# Altium project Roll_Paper_Motor.PrjPCB
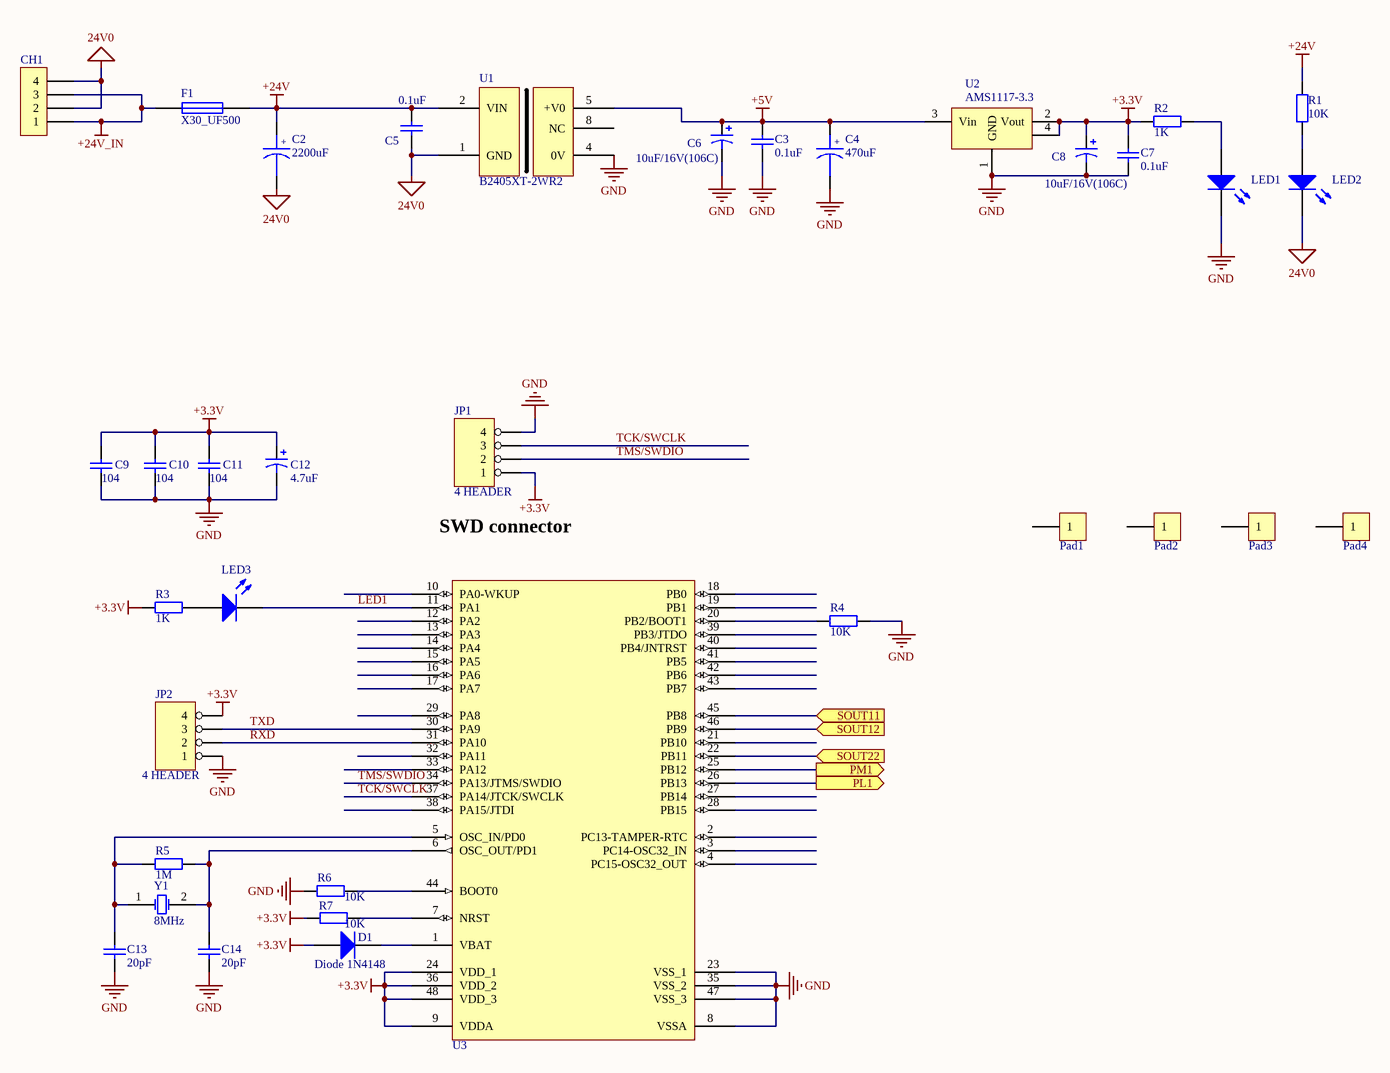
[diagram p0: power_cpu.SchDoc]
3 sheets, 80 parts. Net scope: flat (ports and power ports of the same name join across sheets).
Board files: Roll_Paper_Motor.PcbDoc, PCB_size.PcbDoc
Sheets:
  power_cpu.SchDoc
  senror_input.SchDoc
  roll_paper_output.SchDoc

## Sheet power_cpu.SchDoc
size A3

### Parts
C2  C_2200uF  [C7.8*17]  (value not drawn)
C3  value 0.1uF  [0805]  (hidden comment: Cap)
C4  C_2200uF  [C5*10]  (value not drawn)
C5  value 0.1uF  [0805]  (hidden comment: Cap)
C6  value 10uF/16V(106C)  [CAP A-3216]  (hidden comment: Cap Pol3)
C7  value 0.1uF  [0805]  (hidden comment: Cap)
C8  value 10uF/16V(106C)  [CAP A-3216]  (hidden comment: Cap Pol3)
C9  value 104  [0805]  (hidden comment: Cap)
C10  value 104  [0805]  (hidden comment: Cap)
C11  value 104  [0805]  (hidden comment: Cap)
C12  value 4.7uF  [3225[1210]]  (hidden comment: Cap Pol1)
C13  value 20pF  [0805]  (hidden comment: Cap)
C14  value 20pF  [0805]  (hidden comment: Cap)
CH1  HEADER1X4  [CH3.96-4PIN]  (value not drawn)
D1  Diode 1N4148  [LL34]
F1  X30_UF500  [X30UF600]
JP1  4 HEADER  [CON4_1.5]
JP2  4 HEADER  [HDR1X4]
LED1  (no value)  [LED-0805]
LED2  (no value)  [LED-0805]
LED3  (no value)  [LED-0805]
Pad1  Pad  [pad35]  (value not drawn)
Pad2  Pad  [pad35]  (value not drawn)
Pad3  Pad  [pad35]  (value not drawn)
Pad4  Pad  [pad35]  (value not drawn)
R1  value 10K  [0805]  (hidden comment: Res2)
R2  value 1K  [0805]  (hidden comment: Res2)
R3  value 1K  [0805]  (hidden comment: Res2)
R4  value 10K  [0805]  (hidden comment: Res2)
R5  value 1M  [0805]  (hidden comment: Res2)
R6  value 10K  [0805]  (hidden comment: Res2)
R7  value 10K  [0805]  (hidden comment: Res2)
U1  B2405XT-2WR2  [B2405XT-2WR2]
U2  AMS1117-3.3  [SOT223]
U3  STM32F103C8T6  [LQFP48]  (value not drawn)
Y1  8MHz  [XTAL_US]

### Ports
PL1 (out), PM1 (out), SOUT11 (in), SOUT12 (in), SOUT22 (in)

### Nets
24V0: C2.2 C5.1 CH1.2 CH1.4 LED2.2(K) U1.1(GND)
+3.3V: C7.2 C8.1 C9.2 C10.2 C11.2 C12.1 D1.1(A) JP1.1 JP2.4 R2.2 R3.2 R7.1 U2.2(Vout) U2.4 U3.9(VDDA) U3.24(VDD_1) U3.36(VDD_2) U3.48(VDD_3)
+5V: C3.2 C4.1 C6.1 U1.5(+V0) U2.3(Vin)
+24V: C2.1 C5.2 F1.2 R1.2 U1.2(VIN)
+24V_IN: CH1.1 CH1.3 F1.1
GND: C3.1 C4.2 C6.2 C7.1 C8.2 C9.1 C10.1 C11.1 C12.2 C13.1 C14.1 JP1.4 JP2.1 LED1.2(K) R4.2 R6.1 U1.4(0V) U2.1(GND) U3.8(VSSA) U3.23(VSS_1) U3.35(VSS_2) U3.47(VSS_3)
LED1: LED3.2(K) U3.11(PA1)
RXD: JP2.2 U3.31(PA10)
TCK/SWCLK: JP1.3 U3.37(PA14/JTCK/SWCLK)
TMS/SWDIO: JP1.2 U3.34(PA13/JTMS/SWDIO)
TXD: JP2.3 U3.30(PA9)
NetC13_2: C13.2 R5.1 U3.5(OSC_IN/PD0) Y1.1(OSC1)
NetC14_2: C14.2 R5.2 U3.6(OSC_OUT/PD1) Y1.2(OSC2)
NetC18_2: U3.46(PB9) ; port SOUT12
NetC20_2: U3.45(PB8) ; port SOUT11
NetC24_2: U3.22(PB11) ; port SOUT22
NetD1_2: D1.2(K) U3.1(VBAT)
NetLED1_1: LED1.1(A) R2.1
NetLED2_1: LED2.1(A) R1.1
NetLED3_1: LED3.1(A) R3.1
NetR4_1: R4.1 U3.20(PB2/BOOT1)
NetR6_2: R6.2 U3.44(BOOT0)
NetR7_2: R7.2 U3.7(NRST)
NetR9_1: U3.25(PB12) ; port PM1
NetR11_1: U3.26(PB13) ; port PL1

Not connected (* = marked no-connect by the designer): Pad1 1; Pad2 1; Pad3 1; Pad4 1; U1 8(NC); U3 2(PC13-TAMPER-RTC) 3(PC14-OSC32_IN) 4(PC15-OSC32_OUT) 10(PA0-WKUP) 12(PA2) 13(PA3) 14(PA4) 15(PA5) 16(PA6) 17(PA7) 18(PB0) 19(PB1) 21(PB10) 27(PB14) 28(PB15) 29(PA8) 32(PA11) 33(PA12) 38(PA15/JTDI) 39(PB3/JTDO) 40(PB4/JNTRST) 41(PB5) 42(PB6) 43(PB7)

### Notes on the sheet
- SWD connector
- (in symbol C_2200uF) +; 2200uF; 470uF

### Library data of the parts
C3 C5 C7 C9-C11 C13 C14 = Cap: Capacitor; Published: 8-Jun-2000; LatestRevisionDate: 17-Jul-2002; LatestRevisionNote: Re-released for DXP Platform.; Publisher: Altium Limited
  C3 C5 C7 C9-C11: PackageReference: RAD-0.3
C6 C8 = Cap Pol3: Polarized Capacitor (Surface Mount); Published: 8-Jun-2000; LatestRevisionDate: 17-Jul-2002; LatestRevisionNote: Re-released for DXP Platform.; PackageReference: C0805; Publisher: Altium Limited
C12 = Cap Pol1: Polarized Capacitor (Radial); Published: 8-Jun-2000; LatestRevisionDate: 17-Jul-2002; LatestRevisionNote: Re-released for DXP Platform.; PackageReference: RB7.6-15; Publisher: Altium Limited
D1 = Diode 1N4148: High Conductance Fast Diode; Published: 8-Jun-2000; LatestRevisionDate: 17-Jul-2002; LatestRevisionNote: Re-released for DXP Platform.; DatasheetDocument: 1997; PackageReference: DO-35; Publisher: Altium Limited; Code_JEDEC: DO-204-AH; ComponentLink1Description: Manufacturer Link; ComponentLink1URL: http://www.fairchildsemi.com/; ComponentLink2Description: Datasheet; ComponentLink2URL: http://www.fairchildsemi.com/ds/1N%2F1N4148.pdf
F1 = Fuse 1: Fuse; Published: 8-Jun-2000; LatestRevisionDate: 17-Jul-2002; LatestRevisionNote: Re-released for DXP Platform.; PackageReference: PIN-W2/E2.8; Publisher: Altium Limited
JP1 JP2 = 4 HEADER: 4 Pin Header
LED1-LED3 = LED2: Typical RED, GREEN, YELLOW, AMBER GaAs LED; Published: 8-Jun-2000; LatestRevisionDate: 17-Jul-2002; LatestRevisionNote: Re-released for DXP Platform.; PackageDocument: Feb-2002; PackageReference: 3.2X1.6X1.1; Publisher: Altium Limited
R1-R7 = Res2: Resistor; Published: 8-Jun-2000; LatestRevisionDate: 17-Jul-2002; LatestRevisionNote: Re-released for DXP Platform.; Publisher: Altium Limited
  R1-R3: PackageReference: AXIAL-0.4
U2 = AMS1117-5
Y1 = XTAL: Crystal Oscillator; Published: 8-Jun-2000; LatestRevisionDate: 17-Jul-2002; LatestRevisionNote: Re-released for DXP Platform.; Publisher: Altium Limited

## Sheet senror_input.SchDoc
size A3
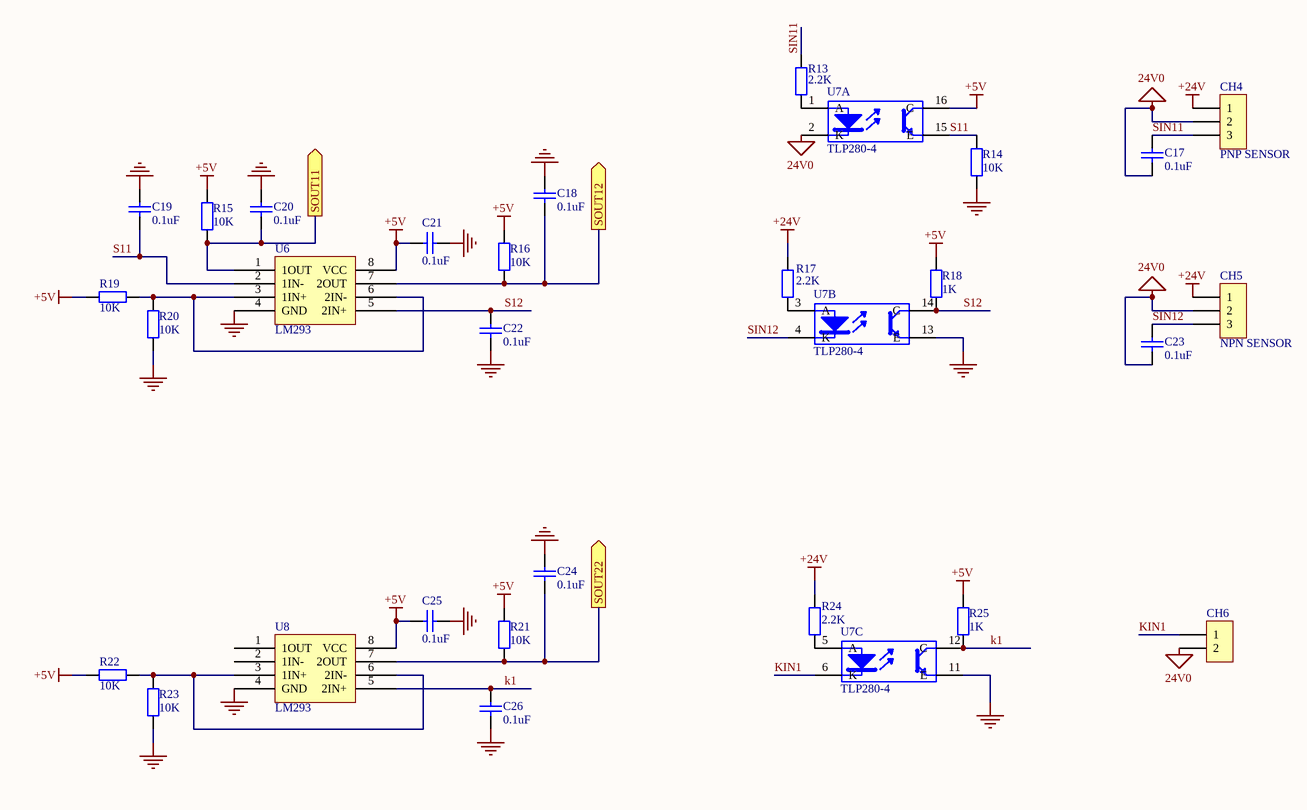
[diagram p1: senror_input.SchDoc]

### Parts
C17  value 0.1uF  [0805]  (hidden comment: Cap)
C18  value 0.1uF  [0805]  (hidden comment: Cap)
C19  value 0.1uF  [0805]  (hidden comment: Cap)
C20  value 0.1uF  [0805]  (hidden comment: Cap)
C21  value 0.1uF  [0805]  (hidden comment: Cap)
C22  value 0.1uF  [0805]  (hidden comment: Cap)
C23  value 0.1uF  [0805]  (hidden comment: Cap)
C24  value 0.1uF  [0805]  (hidden comment: Cap)
C25  value 0.1uF  [0805]  (hidden comment: Cap)
C26  value 0.1uF  [0805]  (hidden comment: Cap)
CH4  HEADER1X3  [CH3.96-3PIN]  (value not drawn)
CH5  HEADER1X3  [CH3.96-3PIN]  (value not drawn)
CH6  HEADER1X2  [CH3.96-2PIN]  (value not drawn)
R13  value 2.2K  [0805]  (hidden comment: Res2)
R14  value 10K  [0805]  (hidden comment: Res2)
R15  value 10K  [0805]  (hidden comment: Res2)
R16  value 10K  [0805]  (hidden comment: Res2)
R17  value 2.2K  [0805]  (hidden comment: Res2)
R18  value 1K  [0805]  (hidden comment: Res2)
R19  value 10K  [0805]  (hidden comment: Res2)
R20  value 10K  [0805]  (hidden comment: Res2)
R21  value 10K  [0805]  (hidden comment: Res2)
R22  value 10K  [0805]  (hidden comment: Res2)
R23  value 10K  [0805]  (hidden comment: Res2)
R24  value 2.2K  [0805]  (hidden comment: Res2)
R25  value 1K  [0805]  (hidden comment: Res2)
U6  LM293  [SOP8-OP27]
U7  TLP280-4  [SO16]  (parts A,B,C of 4)
U8  LM293  [SOP8-OP27]

### Ports
SOUT11 (out), SOUT12 (out), SOUT22 (out)

### Nets
24V0: C17.2 C23.2 CH4.2 CH5.2 CH6.2 U7.2(K)
+5V: C21.2 C25.2 R15.1 R16.1 R18.1 R19.1 R21.1 R22.1 R25.1 U6.8(VCC) U7.16(C) U8.8(VCC)
+24V: CH4.1 CH5.1 R17.1 R24.1
GND: C18.1 C19.1 C20.1 C21.1 C22.1 C24.1 C25.1 C26.1 R14.2 R20.2 R23.2 U6.4(GND) U7.11(E) U7.13(E) U8.4(GND)
k1: C26.2 R25.2 U7.12(C) U8.5(2IN+)
KIN1: CH6.1 U7.6(K)
S11: C19.2 R14.1 U6.2(1IN-) U7.15(E)
S12: C22.2 R18.2 U6.5(2IN+) U7.14(C)
SIN11: C17.1 CH4.3 R13.1
SIN12: C23.1 CH5.3 U7.4(K)
NetC18_2: C18.2 R16.2 U6.7(2OUT) ; port SOUT12
NetC20_2: C20.2 R15.2 U6.1(1OUT) ; port SOUT11
NetC24_2: C24.2 R21.2 U8.7(2OUT) ; port SOUT22
NetR13_2: R13.2 U7.1(A)
NetR17_2: R17.2 U7.3(A)
NetR19_2: R19.2 R20.1 U6.3(1IN+) U6.6(2IN-)
NetR22_2: R22.2 R23.1 U8.3(1IN+) U8.6(2IN-)
NetR24_2: R24.2 U7.5(A)

Not connected (* = marked no-connect by the designer): U8 1(1OUT) 2(1IN-)

### Notes on the sheet
- (in symbol HEADER1X3) PNP SENSOR; NPN SENSOR

### Library data of the parts
C17-C26 = Cap: Capacitor; Published: 8-Jun-2000; LatestRevisionDate: 17-Jul-2002; LatestRevisionNote: Re-released for DXP Platform.; PackageReference: RAD-0.3; Publisher: Altium Limited
R13-R25 = Res2: Resistor; Published: 8-Jun-2000; LatestRevisionDate: 17-Jul-2002; LatestRevisionNote: Re-released for DXP Platform.; PackageReference: AXIAL-0.4; Publisher: Altium Limited
U7 = TLP521-4

## Sheet roll_paper_output.SchDoc
size A3
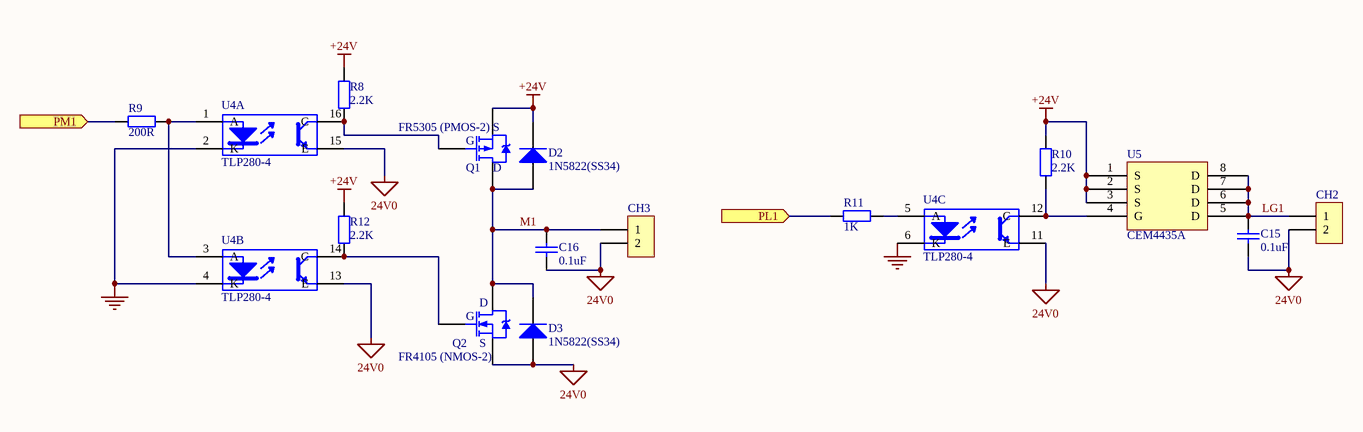
[diagram p2: roll_paper_output.SchDoc]

### Parts
C15  value 0.1uF  [0805]  (hidden comment: Cap)
C16  value 0.1uF  [0805]  (hidden comment: Cap)
CH2  HEADER1X2  [CH3.96-2PIN]  (value not drawn)
CH3  HEADER1X2  [CH3.96-2PIN]  (value not drawn)
D2  1N5822(SS34)  [SMA]
D3  1N5822(SS34)  [SMA]
Q1  FR5305 (PMOS-2)  [TO-252]
Q2  FR4105 (NMOS-2)  [TO-252]
R8  value 2.2K  [0805]  (hidden comment: Res2)
R9  value 200R  [0805]  (hidden comment: Res2)
R10  value 2.2K  [0805]  (hidden comment: Res2)
R11  value 1K  [0805]  (hidden comment: Res2)
R12  value 2.2K  [0805]  (hidden comment: Res2)
U4  TLP280-4  [SO16]  (parts A,B,C of 4)
U5  CEM4435A  [SOP8-OP27]

### Ports
PL1 (in), PM1 (in)

### Nets
24V0: C15.2 C16.2 CH2.2 CH3.2 D3.1(A) Q2.3(S) U4.11(E) U4.13(E) U4.15(E)
+24V: D2.2(K) Q1.3(S) R8.2 R10.2 R12.2 U5.1(S) U5.2(S) U5.3(S)
GND: U4.2(K) U4.4(K) U4.6(K)
LG1: C15.1 CH2.1 U5.5(D) U5.6(D) U5.7(D) U5.8(D)
M1: C16.1 CH3.1 D2.1(A) D3.2(K) Q1.2(D) Q2.2(D)
NetQ1_1: Q1.1(G) R8.1 U4.16(C)
NetQ2_1: Q2.1(G) R12.1 U4.14(C)
NetR9_1: R9.1 ; port PM1
NetR9_2: R9.2 U4.1(A) U4.3(A)
NetR10_1: R10.1 U4.12(C) U5.4(G)
NetR11_1: R11.1 ; port PL1
NetR11_2: R11.2 U4.5(A)

### Notes on the sheet
- (near Q1) S
- (near Q1) G
- (near Q1) D
- (near Q2) G
- (near Q2) D
- (near Q2) S

### Library data of the parts
C15 C16 = Cap: Capacitor; Published: 8-Jun-2000; LatestRevisionDate: 17-Jul-2002; LatestRevisionNote: Re-released for DXP Platform.; PackageReference: RAD-0.3; Publisher: Altium Limited
D2 D3 = Diode 1N4148: High Conductance Fast Diode; Published: 8-Jun-2000; LatestRevisionDate: 17-Jul-2002; LatestRevisionNote: Re-released for DXP Platform.; DatasheetDocument: 1997; PackageReference: DO-35; Publisher: Altium Limited; Code_JEDEC: DO-204-AH; ComponentLink1Description: Manufacturer Link; ComponentLink1URL: http://www.fairchildsemi.com/; ComponentLink2Description: Datasheet; ComponentLink2URL: http://www.fairchildsemi.com/ds/1N%2F1N4148.pdf
Q1 = PMOS-2: P-Channel Power MOSFET; Note: Pin 4 not drawn and electrically connected to Pin 2.; Published: 8-Jun-2000; LatestRevisionDate: 17-Jul-2002; LatestRevisionNote: Re-released for DXP Platform.; DatasheetDocument: PD-9.390D; PackageReference: TO-220AB; Publisher: Altium Limited; Code_JEDEC: TO-220-AB; ComponentLink1Description: Manufacturer Link; ComponentLink1URL: http://www.irf.com/
Q2 = NMOS-2: N-Channel Power MOSFET; Note: Pin 2 is electrically connected to pin 4.; Published: 8-Jun-2000; LatestRevisionDate: 17-Jul-2002; LatestRevisionNote: Re-released for DXP Platform.; DatasheetDocument: PD-9.814; PackageReference: TO-220AB; Publisher: Altium Limited; Code_JEDEC: TO-220-AB; ComponentLink1Description: Manufacturer Link; ComponentLink1URL: http://www.irf.com/
R8-R12 = Res2: Resistor; Published: 8-Jun-2000; LatestRevisionDate: 17-Jul-2002; LatestRevisionNote: Re-released for DXP Platform.; PackageReference: AXIAL-0.4; Publisher: Altium Limited
U4 = TLP521-4

## Nets that join several sheets
24V0: power_cpu (6 pins), senror_input (6 pins), roll_paper_output (9 pins)
+5V: power_cpu (5 pins), senror_input (12 pins)
+24V: power_cpu (5 pins), senror_input (CH4.1 CH5.1 R17.1 R24.1), roll_paper_output (8 pins)
GND: power_cpu (22 pins), senror_input (15 pins), roll_paper_output (U4.2 U4.4 U4.6)
NetC18_2: power_cpu (U3.46), senror_input (C18.2 R16.2 U6.7)
NetC20_2: power_cpu (U3.45), senror_input (C20.2 R15.2 U6.1)
NetC24_2: power_cpu (U3.22), senror_input (C24.2 R21.2 U8.7)
NetR9_1: power_cpu (U3.25), roll_paper_output (R9.1)
NetR11_1: power_cpu (U3.26), roll_paper_output (R11.1)